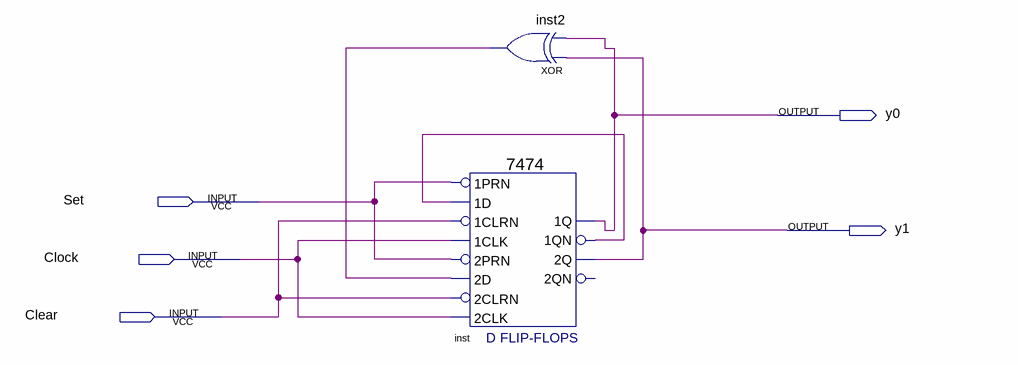
[diagram p0: schematic sheet]
// Quartus schematic binarycounter.bdf as structural Verilog: 2 symbols, 5 pins
module binarycounter (
  input  Set,
  input  Clock,
  input  Clear,
  output y0,
  output y1
);

  wire inst2_out, inst_1qn;

  \7474  inst (
    .\2D (inst2_out), .\2PRN (Set), .\1CLK (Clock), .\1D (inst_1qn), .\1PRN (Set), .\2CLK (Clock),
    .\2CLRN (Clear), .\1CLRN (Clear), .\1QN (inst_1qn), .\2Q (y1), .\1Q (y0));  // open: 2QN
  xor inst2 (inst2_out, y1, y0);
endmodule
